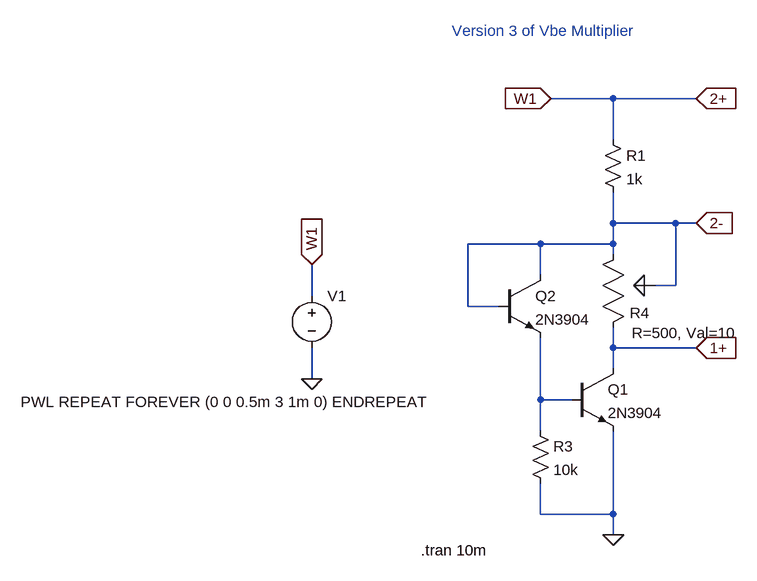
[diagram p0: schematic vbe_circuit3_ltspice.asc]
vbe_circuit3_ltspice.asc, the LTspice schematic file:
Version 4
SHEET 1 880 680
WIRE 208 -496 112 -496
WIRE 336 -496 208 -496
WIRE 208 -432 208 -496
WIRE 208 -304 208 -352
WIRE 304 -304 208 -304
WIRE 336 -304 304 -304
WIRE 96 -272 -16 -272
WIRE 208 -272 208 -304
WIRE 208 -272 96 -272
WIRE 208 -256 208 -272
WIRE 96 -224 96 -272
WIRE 304 -208 304 -304
WIRE 304 -208 272 -208
WIRE -256 -192 -256 -240
WIRE -16 -176 -16 -272
WIRE 32 -176 -16 -176
WIRE 208 -112 208 -144
WIRE 336 -112 208 -112
WIRE 208 -80 208 -112
WIRE -256 -64 -256 -112
WIRE 96 -32 96 -128
WIRE 144 -32 96 -32
WIRE 96 16 96 -32
WIRE 96 144 96 96
WIRE 208 144 208 16
WIRE 208 144 96 144
WIRE 208 176 208 144
FLAG 112 -496 W1
IOPIN 112 -496 In
FLAG -256 -64 0
FLAG -256 -240 W1
IOPIN -256 -240 In
FLAG 208 176 0
FLAG 336 -496 2+
IOPIN 336 -496 In
FLAG 336 -304 2-
IOPIN 336 -304 In
FLAG 336 -112 1+
IOPIN 336 -112 In
SYMBOL npn 144 -80 R0
SYMATTR InstName Q1
SYMATTR Value 2N3904
SYMBOL res 192 -448 R0
SYMATTR InstName R1
SYMATTR Value 1k
SYMBOL voltage -256 -208 R0
WINDOW 3 -448 179 Left 2
WINDOW 123 0 0 Left 0
WINDOW 39 0 0 Left 0
SYMATTR Value PWL REPEAT FOREVER (0 0 0.5m 3 1m 0) ENDREPEAT
SYMATTR InstName V1
SYMBOL res 80 0 R0
SYMATTR InstName R3
SYMATTR Value 10k
SYMBOL potentiometer 224 -240 M0
WINDOW 0 -40 74 Left 2
WINDOW 39 -174 105 Left 2
SYMATTR InstName R4
SYMATTR SpiceLine R=500, Val=10
SYMBOL npn 32 -224 R0
SYMATTR InstName Q2
SYMATTR Value 2N3904
TEXT -88 200 Left 2 !.tran 10m
TEXT -40 -600 Left 2 ;Version 3 of Vbe Multiplier

The netlist it stands for:
* vbe_circuit3_ltspice.asc
Q1 1+ N001 0 0 2N3904
R1 2+ 2- 1k
V1 2+ 0 PWL REPEAT FOREVER (0 0 0.5m 3 1m 0) ENDREPEAT
R3 N001 0 10k
XR4 2- 2- 1+ potentiometer R=500, Val=10  ; pins 1 2 3
Q2 2- 2- N001 0 2N3904
.model NPN NPN
.model PNP PNP
.lib standard.bjt
.tran 10m
* Version 3 of Vbe Multiplier
.backanno
.end